# EAGLE schematic RTC_CLOCK_TIMER_STOPWATCH (EAGLE 8.7.1)
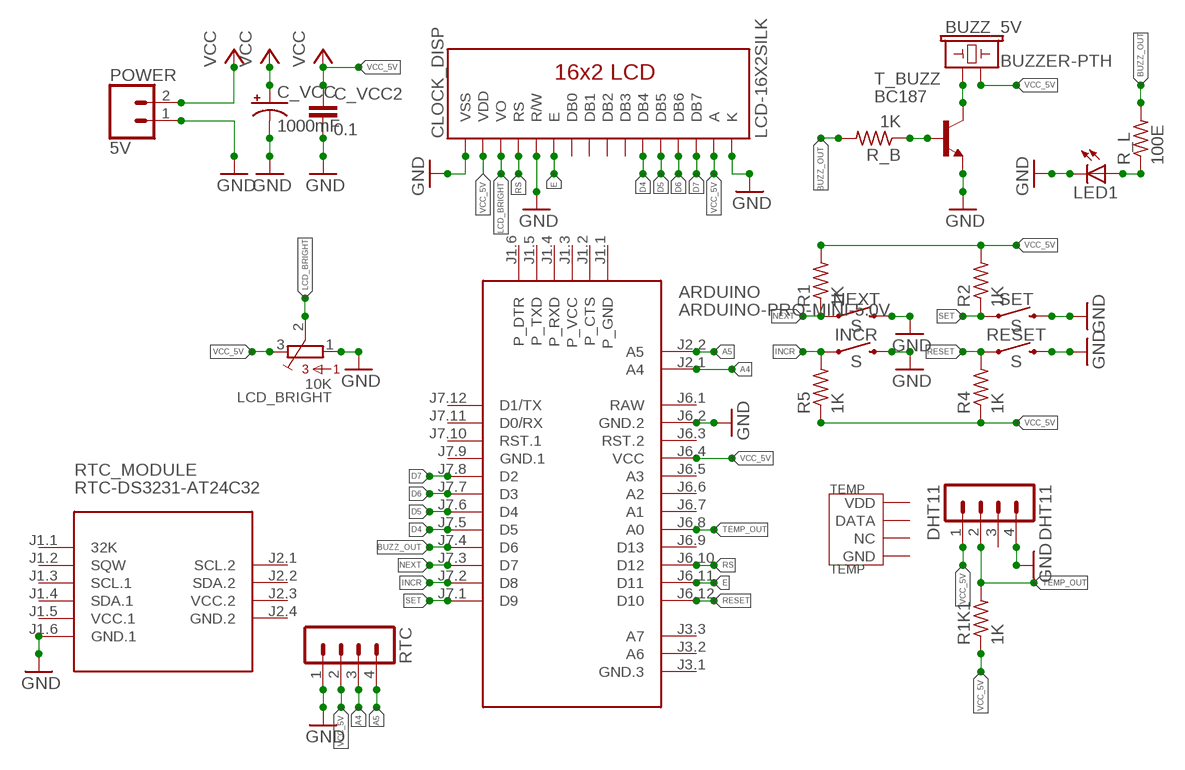
[diagram p0: schematic, sheet 1]

## Parts
ARDUINO  ARDUINO-PRO-MINI-5.0V  [ARDUINO-PRO-MINI]
BUZZ_5V  BUZZER-PTH  [BUZZER-12MM]
C_VCC  1000mF  1000UF-RADIAL-5MM-25V-20%  [CPOL-RADIAL-5MM-10MM]
C_VCC2  0.1  C-EU050-024X044  [C050-024X044]
CLOCK_DISP  LCD-16X2SILK  [LCD-16X2]
DHT11  DHT11  MA04-1  [MA04-1]
INCR  S  MOMENTARY-SWITCH-SPST-PTH-6.0MM  [TACTILE_SWITCH_PTH_6.0MM]
LCD_BRIGHT  10K  3362P  [3362P]
LED1  LED5MM  [LED5MM]
NEXT  S  MOMENTARY-SWITCH-SPST-PTH-6.0MM  [TACTILE_SWITCH_PTH_6.0MM]
POWER  5V  CONN_02JST-PTH-2-KIT  [JST-2-PTH-KIT]
R1  1K  R-US_0204/7  [0204/7]
R1K1  1K  R-US_0204/7  [0204/7]
R2  1K  R-US_0204/7  [0204/7]
R4  1K  R-US_0204/7  [0204/7]
R5  1K  R-US_0204/7  [0204/7]
R_B  1K  R-US_0204/7  [0204/7]
R_L  100E  R-US_0204/7  [0204/7]
RESET  S  MOMENTARY-SWITCH-SPST-PTH-6.0MM  [TACTILE_SWITCH_PTH_6.0MM]
RTC  MA04-1  [MA04-1]
RTC_MODULE  RTC-DS3231-AT24C32  [RTC-DS3231-AT24C32]
SET  S  MOMENTARY-SWITCH-SPST-PTH-6.0MM  [TACTILE_SWITCH_PTH_6.0MM]
T_BUZZ  BC187  2N2222  [TO92-EBC-OVAL]
TEMP  TEMP  TEM-HUM-DHT11(4P-15.5X12.0MM)  [SNR4-2.54-15.5X12.0X5.5MM]

## Nets
A4: ARDUINO.J2.1(A4) RTC.3
A5: ARDUINO.J2.2(A5) RTC.4
BUZZ_OUT: ARDUINO.J7.4(D6) R_B.2 R_L.2
D4: ARDUINO.J7.5(D5) CLOCK_DISP.11(DB4)
D5: ARDUINO.J7.6(D4) CLOCK_DISP.12(DB5)
D6: ARDUINO.J7.7(D3) CLOCK_DISP.13(DB6)
D7: ARDUINO.J7.8(D2) CLOCK_DISP.14(DB7)
E: ARDUINO.J6.11(D11) CLOCK_DISP.6(E)
GND: ARDUINO.J6.2(GND.2) C_VCC2.2 C_VCC.- CLOCK_DISP.1(VSS) CLOCK_DISP.5(R/W) CLOCK_DISP.16(K) DHT11.4 INCR.3 LED1.K(C) NEXT.3 POWER.1 RESET.3 RTC.1 SET.3 T_BUZZ.E
INCR: ARDUINO.J7.2(D8) INCR.1 R5.2
LCD_BRIGHT: CLOCK_DISP.3(VO) LCD_BRIGHT.2
N$7: LCD_BRIGHT.1 ; supply symbol labelled GND
N$9: R_B.1 T_BUZZ.B
N$10: BUZZ_5V.+ T_BUZZ.C
N$11: LED1.A R_L.1
NEXT: ARDUINO.J7.3(D7) NEXT.1 R1.1
RESET: ARDUINO.J6.12(D10) R4.2 RESET.1
RS: ARDUINO.J6.10(D12) CLOCK_DISP.4(RS)
SET: ARDUINO.J7.1(D9) R2.1 SET.1
TEMP_OUT: ARDUINO.J6.8(A0) DHT11.2 R1K1.2
VCC: C_VCC.+ POWER.2
VCC_5V: ARDUINO.J6.4(VCC) BUZZ_5V.- C_VCC2.1 CLOCK_DISP.2(VDD) CLOCK_DISP.15(A) DHT11.1 LCD_BRIGHT.3 R1.2 R1K1.1 R2.2 R4.1 R5.1 RTC.2 ; supply symbol labelled VCC
Unconnected: ARDUINO.J1.1(P_GND) ARDUINO.J1.2(P_CTS) ARDUINO.J1.3(P_VCC) ARDUINO.J1.4(P_RXD) ARDUINO.J1.5(P_TXD) ARDUINO.J1.6(P_DTR) ARDUINO.J3.1(GND.3) ARDUINO.J3.2(A6) ARDUINO.J3.3(A7) ARDUINO.J6.3(RST.2) ARDUINO.J6.5(A3) ARDUINO.J6.6(A2) ARDUINO.J6.7(A1) ARDUINO.J6.9(D13) ARDUINO.J7.10(RST.1) ARDUINO.J7.11(D0/RX) ARDUINO.J7.12(D1/TX) CLOCK_DISP.7(DB0) CLOCK_DISP.8(DB1) CLOCK_DISP.9(DB2) CLOCK_DISP.10(DB3) DHT11.3 RTC_MODULE.J1.1(32K) RTC_MODULE.J1.2(SQW) RTC_MODULE.J1.3(SCL.1) RTC_MODULE.J1.4(SDA.1) RTC_MODULE.J2.1(SCL.2) RTC_MODULE.J2.2(SDA.2) TEMP.1(VDD) TEMP.2(DATA) TEMP.3(NC) TEMP.4(GND)

## Power pins joined to a net without a drawn wire
GND.1: ARDUINO.J7.9(GND.1) RTC_MODULE.J1.6(GND.1)
GND.2: RTC_MODULE.J2.4(GND.2)
RAW: ARDUINO.J6.1(RAW)
VCC.1: RTC_MODULE.J1.5(VCC.1)
VCC.2: RTC_MODULE.J2.3(VCC.2)

## Library data of the parts
ARDUINO = diy-modules:ARDUINO-PRO-MINI-*: Arduino Pro Mini and compatible devices More details available here: https://www.arduino.cc/en/Main/ArduinoBoardProMini Click here to find device on ebay.com <http://www.ebay.com/sch/arduino+pro+mini>
BUZZ_5V = SparkFun-Electromechanical:BUZZER: Buzzer Small round buzzers that operate around the audible 2kHz range. You can use these as speakers to create simple music or user interfaces. Variant Overview: PTH - Mini Speaker - PC Mount 12mm 2.048kHz <https://www.sparkfun.com/products/7950> PTH_KIT - Mini Speaker - PC Mount 12mm 2.048kHz <https://www.sparkfun.com/products/7950> KIT simplifies soldering by adding stop mask to one side of the pads. PTH_NO_SILK - Mini Speaker - PC Mount 12mm 2.048kHz <https://www.sparkfun.com/products/7950> No silkscreen indicator of buzzer outline. PTH_KIT_NO_SILK - Mini Speaker - PC Mount 12mm 2.048kHz <https://www.sparkfun.com/products/7950> KIT package w/o silkscreen SMD - Buzzer Audio Magnetic (CCV-084B16) SMD buzzer used on, e.g. the LilyPad Buzzer <https://www.sparkfun.com/products/8463> and RFID USB Reader <https://www.sparkfun.com/products/9963>. SMD_KIT - Buzzer Audio Magnetic (CCV-084B16) SMD Buzzer with elongated pins to make soldering easier. Used on the SparkFun Simon Says - Surface Mount Soldering Kit <https://www.sparkfun.com/products/10935>.; PROD_ID: COMP-08253; SF_SKU: COM-07950
C_VCC = SparkFun-Capacitors:1000UF: 1,000µF/1mF ceramic capacitors A capacitor is a passive two-terminal electrical component used to store electrical energy temporarily in an electric field. CAP-08070; PROD_ID: CAP-09538; VALUE: 1mF
C_VCC2 = rcl:C-EU: CAPACITOR, European symbol; SPICEPREFIX: C
CLOCK_DISP = SparkFun-Displays:LCD-16X2: Standard text-only 16x2 parallel input LCD Basic 16 character by 2 line display. Typically utilizes the extremely common HD44780 parallel interface chipset SparkFun Products: Basic 16x2 Green <https://www.sparkfun.com/products/255> Basic 8x2 Green <https://www.sparkfun.com/products/11122>; SF_ID: LCD-00255
DHT11 RTC = con-lstb:MA04-1: PIN HEADER; OC_FARNELL: unknown; OC_NEWARK: unknown
INCR NEXT RESET SET = SparkFun-Switches:MOMENTARY-SWITCH-SPST: Momentary Switch (Pushbutton) - SPST Normally-open (NO) SPST momentary switches (buttons, pushbuttons). Variants PTH-12MM - 12mm square, through-hole Momentary Pushbutton Switch - 12mm Square <https://www.sparkfun.com/products/9190> (COM-09190) PTH-6.0MM, PTH-6.0MM-KIT - 6.0mm square, through-hole Mini Pushbutton Switch <https://www.sparkfun.com/products/97> (COM-00097) KIT package intended for soldering kit's - only one side of pads' copper is exposed. PTH-RIGHT-ANGLE-KIT - Right-angle, through-hole Right Angle Tactile Button <https://www.sparkfun.com/products/10791> - Used on SparkFun BigTime Watch Kit <https://www.sparkfun.com/products/11734> SMD-12MM - 12mm square, surface-mount Tactile Button - SMD (12mm) <https://www.sparkfun.com/products/12993> (COM-12993) Used on SparkFun PicoBoard <https://www.sparkfun.com/products/11888> SMD-4.5MM - 4.5mm Square Trackball Switch Used on SparkFun Blackberry Trackballer Breakout <https://www.sparkfun.com/products/13169> SMD-4.6MMX2.8MM - 4.60mm x 2.80mm, surface mount Used on SparkFun SAMD21 Mini Breakout <https://www.sparkfun.com/products/13664> SMD-5.2MM, SMD-5.2-REDUNDANT - 5.2mm square, surface-mount Mini Pushbutton Switch - SMD <https://www.sparkfun.com/products/8720> (COM-08720) Used on Arduino Pro Mini <https://www.sparkfun.com/products/11114> REDUNDANT package connects both switch circuits together SMD-6.0X3.5MM - 6.0 x 3.5mm, surface mount Momentary Reset Switch SMD <https://www.sparkfun.com/products/8229> (COM-08229) SMD-6.2MM-TALL - 6.2mm square, surface mount Tactile Button - SMD (6mm) <https://www.sparkfun.com/products/12992> Used on SparkFun Digital Sandbox <https://www.sparkfun.com/products/12651> SMD-RIGHT-ANGLE - Right-angle, surface mount Used on SparkFun Block for Intel® Edison - Arduino <https://www.sparkfun.com/products/13036>; PROD_ID: SWCH-08441; SF_SKU: COM-00097
LCD_BRIGHT = bourns:3362: 3362 Series 1/4" Square Trimmer
LED1 = adafruit:LED: LED OSRAM: - CHIPLED LG R971, LG N971, LY N971, LG Q971, LY Q971, LO R971, LY R971 LH N974, LH R974 LS Q976, LO Q976, LY Q976 LO Q996 - Hyper CHIPLED LW Q18S LB Q993, LB Q99A, LB R99A - SideLED LS A670, LO A670, LY A670, LG A670, LP A670 LB A673, LV A673, LT A673, LW A673 LH A674 LY A675 LS A676, LA A676, LO A676, LY A676, LW A676 LS A679, LY A679, LG A679 - Hyper Micro SIDELED® LS Y876, LA Y876, LO Y876, LY Y876 LT Y87S - SmartLED LW L88C, LW L88S LB L89C, LB L89S, LG L890 LS L89K, LO L89K, LY L89K LS L896, LA L896, LO L896, LY L896 - TOPLED LS T670, LO T670, LY T670, LG T670, LP T670 LSG T670, LSP T670, LSY T670, LOP T670, LYG T670 LG T671, LOG T671, LSG T671 LB T673, LV T673, LT T673, LW T673 LH T674 LS T676, LA T676, LO T676, LY T676, LB T676, LH T676, LSB T676, LW T676 LB T67C, LV T67C, LT T67C, LS T67K, LO T67K, LY T67K, LW E67C LS E67B, LA E67B, LO E67B, LY E67B, LB E67C, LV E67C, LT E67C LW T67C LS T679, LY T679, LG T679 LS T770, LO T770, LY T770, LG T770, LP T770 LB T773, LV T773, LT T773, LW T773 LH T774 LS E675, LA E675, LY E675, LS T675 LS T776, LA T776, LO T776, LY T776, LB T776 LHGB T686 LT T68C, LB T68C - Hyper Mini TOPLED® LB M676 - Mini TOPLED Santana® LG M470 LS M47K, LO M47K, LY M47K Source: http://www.osram.convergy.de/
POWER = SparkFun-Connectors:CONN_02: Multi connection point. Often used as Generic Header-pin footprint for 0.1 inch spaced/style header connections On any of the 0.1 inch spaced packages, you can populate with these: Break Away Headers - Straight <https://www.sparkfun.com/products/116> (PRT-00116) Break Away Male Headers - Right Angle <https://www.sparkfun.com/products/553> (PRT-00553) Female Headers <https://www.sparkfun.com/products/115> (PRT-00115) Break Away Headers - Machine Pin <https://www.sparkfun.com/products/117> (PRT-00117) Break Away Female Headers - Swiss Machine Pin <https://www.sparkfun.com/products/743> (PRT-00743) For SCREWTERMINALS and SPRING TERMINALS visit here: Screw Terimnals on SparkFun.com <https://www.sparkfun.com/search/results?term=Screw+Terminals> (5mm/3.5mm/2.54mm spacing) This device is also useful as a general connection point to wire up your design to another part of your project. Our various solder wires solder well into these plated through hole pads. Hook-Up Wire - Assortment (Stranded, 22 AWG) <https://www.sparkfun.com/products/11375> (PRT-11375) Hook-Up Wire - Assortment (Solid Core, 22 AWG) <https://www.sparkfun.com/products/11367> (PRT-11367) View the entire wire category on our website here <https://www.sparkfun.com/categories/141> Special notes: Molex polarized connector foot print use with: PRT-08233 with associated crimp pins and housings. 2.54_SCREWTERM for use with PRT-10571. 3.5mm Screw Terminal footprints for PRT-08084 5mm Screw Terminal footprints for use with PRT-08432
R1 R1K1 R2 R4 R5 R_B R_L = rcl:R-US_: RESISTOR, American symbol
RTC_MODULE = diy-modules:RTC-DS3231-AT24C32: RTC Module with Battery and EEPROM based on DS3231 and AT24C32 chips Tutorial can be found here: https://edwardmallon.wordpress.com/2014/05/21/using-a-cheap-3-ds3231-rtc-at24c32-eeprom-from-ebay/ Click here to find device on ebay.com <http://www.ebay.com/sch/DS3231+AT24C32+module>
T_BUZZ = adafruit:2N2222: NPN TRANSISTOR Big oval pads
TEMP = Seeed-Sensor:TEM-HUM-DHT11(4P-15.5X12.0MM): 314010000; MPN: DHT11; VALUE: DHT11